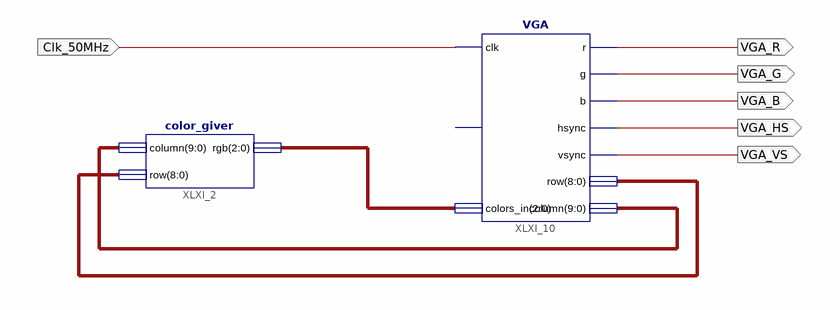
[diagram p0: schematic sheet 1]
// Xilinx ISE schematic uklad.sch (spartan3e) as structural Verilog: 2 symbols, 6 ports
module uklad (
  input  Clk_50MHz,
  output VGA_VS,
  output VGA_HS,
  output VGA_G,
  output VGA_R,
  output VGA_B
);

  wire [2:0] XLXN_1;
  wire [8:0] XLXN_41;
  wire [9:0] XLXN_2;

  color_giver XLXI_2 (.column(XLXN_2), .row(XLXN_41), .rgb(XLXN_1));
  VGA XLXI_10 (
    .clk(Clk_50MHz), .colors_in(XLXN_1), .r(VGA_R), .g(VGA_G), .b(VGA_B), .hsync(VGA_HS), .vsync(VGA_VS),
    .row(XLXN_41), .column(XLXN_2));  // open: reset
endmodule
